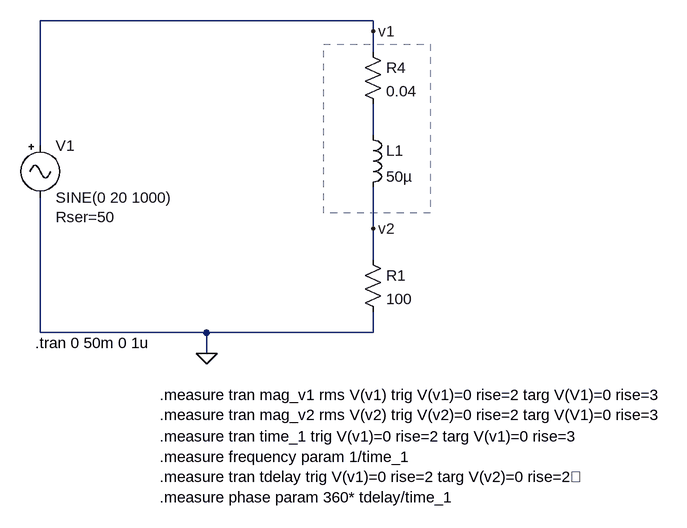
[diagram p0: schematic diy-vna-simple.asc]
diy-vna-simple.asc, the LTspice schematic file:
Version 4
SHEET 1 1200 768
WIRE 368 48 -144 48
WIRE 368 64 368 48
WIRE 368 96 368 64
WIRE 368 224 368 176
WIRE -144 240 -144 48
WIRE 368 368 368 304
WIRE 368 416 368 368
WIRE -144 528 -144 320
WIRE 112 528 -144 528
WIRE 368 528 368 496
WIRE 368 528 112 528
WIRE 112 560 112 528
FLAG 112 560 0
FLAG 368 368 v2
FLAG 368 64 v1
SYMBOL Misc/signal -144 224 R0
WINDOW 39 24 126 Left 2
SYMATTR SpiceLine Rser=50
SYMATTR InstName V1
SYMATTR Value SINE(0 20 1000)
SYMBOL res 352 400 R0
SYMATTR InstName R1
SYMATTR Value 100
SYMBOL ind 352 208 R0
SYMATTR InstName L1
SYMATTR Value 50µ
SYMATTR SpiceLine Rser=0
SYMBOL res 352 80 R0
SYMATTR InstName R4
SYMATTR Value 0.04
TEXT -152 544 Left 2 !.tran 0 50m 0 1u
TEXT 40 688 Left 2 !.measure tran time_1 trig V(v1)=0 rise=2 targ V(v1)=0 rise=3\n.measure frequency param 1/time_1\n.measure tran tdelay trig V(v1)=0 rise=2 targ V(v2)=0 rise=2\n.measure phase param 360* tdelay/time_1
TEXT 40 624 Left 2 !.measure tran mag_v1 rms V(v1) trig V(v1)=0 rise=2 targ V(V1)=0 rise=3\n.measure tran mag_v2 rms V(v2) trig V(v2)=0 rise=2 targ V(V1)=0 rise=3
RECTANGLE Normal 292 84 456 344 2

The netlist it stands for:
* diy-vna-simple.asc
V1 v1 0 SINE(0 20 1000) Rser=50
R1 v2 0 100
L1 N001 v2 50µ Rser=0
R4 v1 N001 0.04
.tran 0 50m 0 1u
.measure tran time_1 trig V(v1)=0 rise=2 targ V(v1)=0 rise=3
.measure frequency param 1/time_1
.measure tran tdelay trig V(v1)=0 rise=2 targ V(v2)=0 rise=2
.measure phase param 360* tdelay/time_1
.measure tran mag_v1 rms V(v1) trig V(v1)=0 rise=2 targ V(V1)=0 rise=3
.measure tran mag_v2 rms V(v2) trig V(v2)=0 rise=2 targ V(V1)=0 rise=3
.backanno
.end